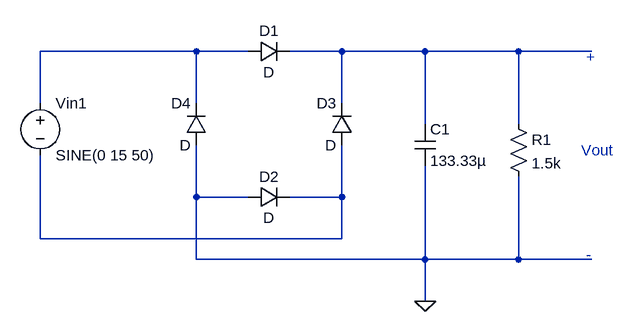
[diagram p0: schematic Bridge_Rectifier.asc]
Bridge_Rectifier.asc, the LTspice schematic file:
Version 4
SHEET 1 888 680
WIRE 224 176 -16 176
WIRE 304 176 224 176
WIRE 448 176 368 176
WIRE 576 176 448 176
WIRE 720 176 576 176
WIRE 832 176 720 176
WIRE -16 256 -16 176
WIRE 224 256 224 176
WIRE 448 256 448 176
WIRE 576 288 576 176
WIRE 720 288 720 176
WIRE 224 400 224 320
WIRE 304 400 224 400
WIRE 448 400 448 320
WIRE 448 400 368 400
WIRE -16 464 -16 336
WIRE 448 464 448 400
WIRE 448 464 -16 464
WIRE 224 496 224 400
WIRE 576 496 576 352
WIRE 576 496 224 496
WIRE 720 496 720 368
WIRE 720 496 576 496
WIRE 832 496 720 496
WIRE 576 560 576 496
FLAG 576 560 0
SYMBOL diode 304 192 R270
WINDOW 0 32 32 VTop 2
WINDOW 3 0 32 VBottom 2
SYMATTR InstName D1
SYMBOL diode 304 416 R270
WINDOW 0 32 32 VTop 2
WINDOW 3 0 32 VBottom 2
SYMATTR InstName D2
SYMBOL diode 464 320 R180
WINDOW 0 24 64 Left 2
WINDOW 3 24 0 Left 2
SYMATTR InstName D3
SYMBOL diode 240 320 R180
WINDOW 0 24 64 Left 2
WINDOW 3 24 0 Left 2
SYMATTR InstName D4
SYMBOL voltage -16 240 R0
SYMATTR InstName Vin1
SYMATTR Value SINE(0 15 50)
SYMBOL res 704 272 R0
SYMATTR InstName R1
SYMATTR Value 1.5k
SYMBOL cap 560 288 R0
SYMATTR InstName C1
SYMATTR Value 133.33µ
TEXT 816 328 Left 2 ;Vout
TEXT 824 184 Left 2 ;+
TEXT 824 488 Left 2 ;-

The netlist it stands for:
* Bridge_Rectifier.asc
D1 N001 N002 D
D2 0 N003 D
D3 N003 N002 D
D4 0 N001 D
Vin1 N001 N003 SINE(0 15 50)
R1 N002 0 1.5k
C1 N002 0 133.33µ
.model D D
.lib standard.dio
* Vout
* +
* -
.backanno
.end